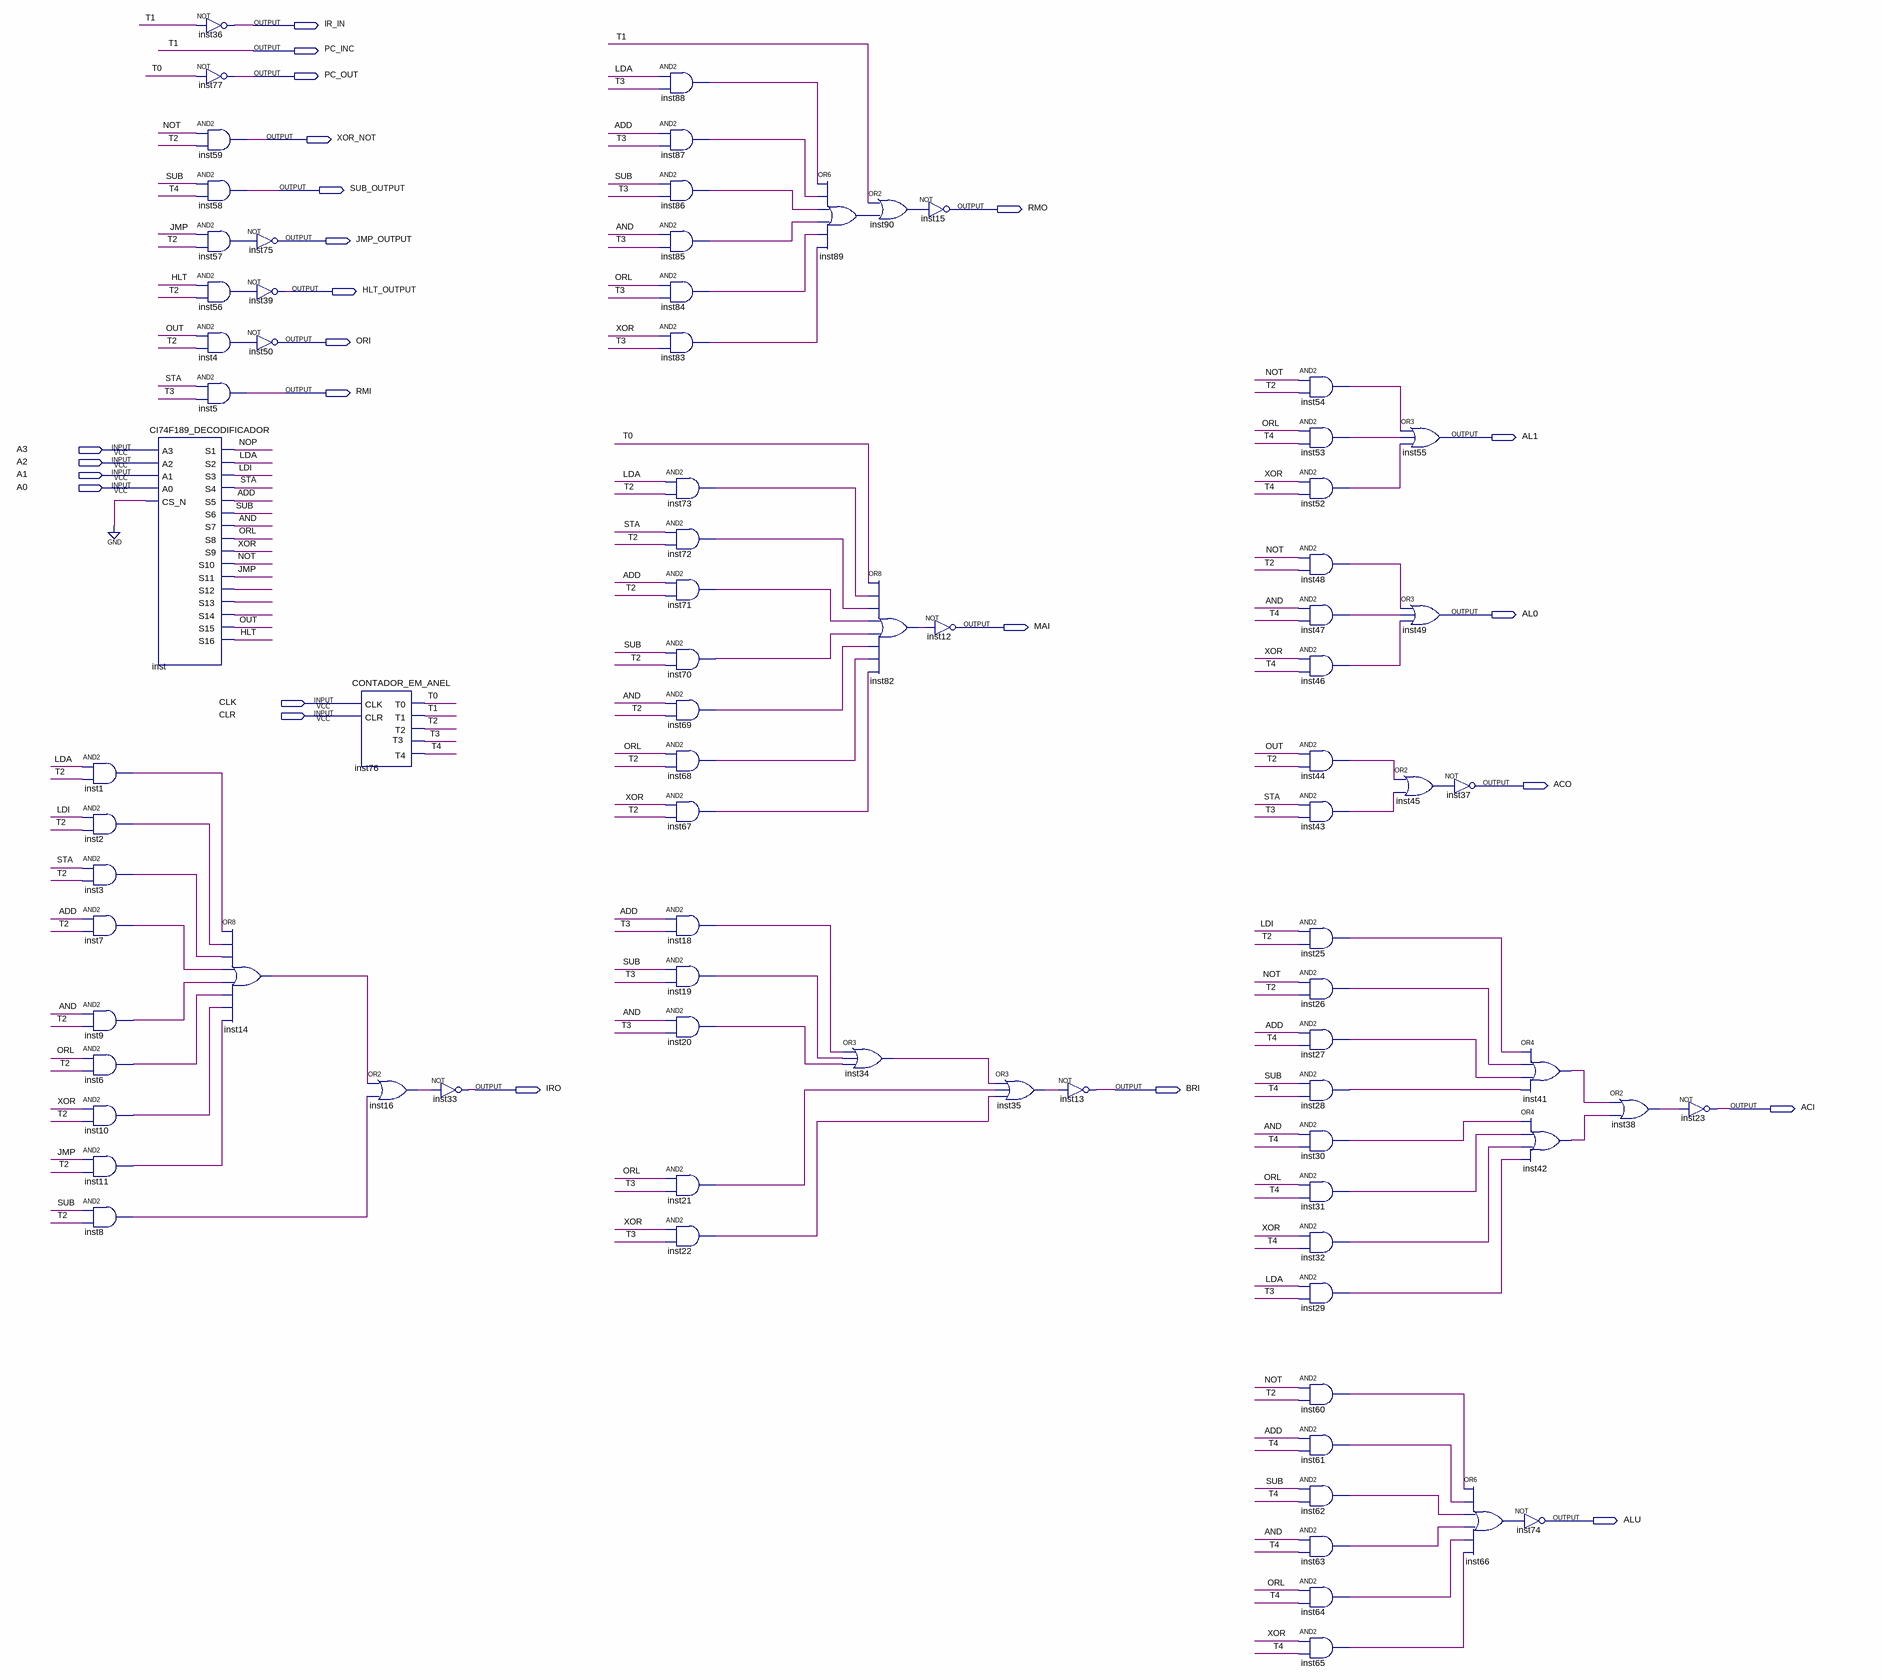
[diagram p0: schematic sheet]
// Quartus schematic CONTROLLER.bdf as structural Verilog: 83 symbols, 24 pins
module CONTROLLER (
  input  A3,
  input  A2,
  input  A1,
  input  A0,
  input  CLK,
  input  CLR,
  output IR_IN,
  output PC_INC,
  output PC_OUT,
  output XOR_NOT,
  output SUB_OUTPUT,
  output RMO,
  output JMP_OUTPUT,
  output HLT_OUTPUT,
  output ORI,
  output RMI,
  output AL1,
  output AL0,
  output MAI,
  output ACO,
  output IRO,
  output BRI,
  output ACI,
  output ALU
);

  wire ADD, AND, HLT, inst1_out, inst2_out, inst3_out, inst4_out, inst6_out, inst7_out, inst8_out, inst9_out,
       inst10_out, inst11_out, inst14_out, inst16_out, inst18_out, inst19_out, inst20_out, inst21_out,
       inst22_out, inst25_out, inst26_out, inst27_out, inst28_out, inst29_out, inst30_out, inst31_out,
       inst32_out, inst34_out, inst35_out, inst38_out, inst41_out, inst42_out, inst43_out, inst44_out,
       inst45_out, inst46_out, inst47_out, inst48_out, inst52_out, inst53_out, inst54_out, inst56_out,
       inst57_out, inst60_out, inst61_out, inst62_out, inst63_out, inst64_out, inst65_out, inst66_out,
       inst67_out, inst68_out, inst69_out, inst70_out, inst71_out, inst72_out, inst73_out, inst82_out,
       inst83_out, inst84_out, inst85_out, inst86_out, inst87_out, inst88_out, inst89_out, inst90_out,
       inst_s12, inst_s13, inst_s14, JMP, LDA, LDI, NOP, NOT, ORL, OUT, STA, SUB, T0, T2, T3, T4, XOR;

  and inst1 (inst1_out, LDA, T2);
  and inst2 (inst2_out, LDI, T2);
  and inst3 (inst3_out, STA, T2);
  and inst7 (inst7_out, ADD, T2);
  and inst9 (inst9_out, AND, T2);
  and inst6 (inst6_out, ORL, T2);
  and inst10 (inst10_out, XOR, T2);
  and inst11 (inst11_out, JMP, T2);
  and inst8 (inst8_out, SUB, T2);
  CI74F189_DECODIFICADOR inst (
    .A0(A0), .A3(A3), .A2(A2), .A1(A1), .CS_N(1'b0), .S1(NOP), .S2(LDA), .S3(LDI), .S4(STA), .S5(ADD),
    .S6(SUB), .S7(AND), .S8(ORL), .S9(XOR), .S10(NOT), .S11(JMP), .S12(inst_s12), .S13(inst_s13),
    .S14(inst_s14), .S15(OUT), .S16(HLT));
  not inst36 (IR_IN, PC_INC);
  not inst77 (PC_OUT, T0);
  and inst59 (XOR_NOT, NOT, T2);
  and inst58 (SUB_OUTPUT, SUB, T4);
  and inst57 (inst57_out, JMP, T2);
  and inst56 (inst56_out, HLT, T2);
  and inst4 (inst4_out, OUT, T2);
  and inst5 (RMI, STA, T3);
  or inst14 (inst14_out, inst1_out, inst2_out, inst3_out, inst7_out, inst9_out, inst6_out, inst10_out, inst11_out);
  not inst75 (JMP_OUTPUT, inst57_out);
  not inst39 (HLT_OUTPUT, inst56_out);
  not inst50 (ORI, inst4_out);
  CONTADOR_EM_ANEL inst76 (.CLK(CLK), .CLR(CLR), .T0(T0), .T3(T3), .T1(PC_INC), .T2(T2), .T4(T4));
  or inst16 (inst16_out, inst14_out, inst8_out);
  not inst33 (IRO, inst16_out);
  and inst88 (inst88_out, LDA, T3);
  and inst87 (inst87_out, ADD, T3);
  and inst86 (inst86_out, SUB, T3);
  and inst85 (inst85_out, AND, T3);
  and inst84 (inst84_out, ORL, T3);
  and inst83 (inst83_out, XOR, T3);
  and inst73 (inst73_out, LDA, T2);
  and inst72 (inst72_out, STA, T2);
  and inst71 (inst71_out, ADD, T2);
  and inst70 (inst70_out, SUB, T2);
  and inst69 (inst69_out, AND, T2);
  and inst68 (inst68_out, ORL, T2);
  and inst67 (inst67_out, XOR, T2);
  and inst18 (inst18_out, ADD, T3);
  and inst19 (inst19_out, SUB, T3);
  and inst20 (inst20_out, AND, T3);
  and inst21 (inst21_out, ORL, T3);
  and inst22 (inst22_out, XOR, T3);
  or inst89 (inst89_out, inst88_out, inst87_out, inst86_out, inst85_out, inst84_out, inst83_out);
  or inst90 (inst90_out, PC_INC, inst89_out);
  or inst82 (inst82_out, T0, inst73_out, inst72_out, inst71_out, inst70_out, inst69_out, inst68_out, inst67_out);
  or inst34 (inst34_out, inst18_out, inst19_out, inst20_out);
  not inst15 (RMO, inst90_out);
  not inst12 (MAI, inst82_out);
  or inst35 (inst35_out, inst34_out, inst21_out, inst22_out);
  not inst13 (BRI, inst35_out);
  and inst54 (inst54_out, NOT, T2);
  and inst53 (inst53_out, ORL, T4);
  and inst52 (inst52_out, XOR, T4);
  and inst48 (inst48_out, NOT, T2);
  and inst47 (inst47_out, AND, T4);
  and inst46 (inst46_out, XOR, T4);
  and inst44 (inst44_out, OUT, T2);
  and inst43 (inst43_out, STA, T3);
  and inst25 (inst25_out, LDI, T2);
  and inst26 (inst26_out, NOT, T2);
  and inst27 (inst27_out, ADD, T4);
  and inst28 (inst28_out, SUB, T4);
  and inst30 (inst30_out, AND, T4);
  and inst31 (inst31_out, ORL, T4);
  and inst32 (inst32_out, XOR, T4);
  and inst29 (inst29_out, LDA, T3);
  and inst60 (inst60_out, NOT, T2);
  and inst61 (inst61_out, ADD, T4);
  and inst62 (inst62_out, SUB, T4);
  and inst63 (inst63_out, AND, T4);
  and inst64 (inst64_out, ORL, T4);
  and inst65 (inst65_out, XOR, T4);
  or inst55 (AL1, inst54_out, inst53_out, inst52_out);
  or inst49 (AL0, inst48_out, inst47_out, inst46_out);
  or inst45 (inst45_out, inst44_out, inst43_out);
  not inst37 (ACO, inst45_out);
  or inst66 (inst66_out, inst60_out, inst61_out, inst62_out, inst63_out, inst64_out, inst65_out);
  or inst41 (inst41_out, inst25_out, inst26_out, inst27_out, inst28_out);
  or inst42 (inst42_out, inst30_out, inst31_out, inst32_out, inst29_out);
  not inst74 (ALU, inst66_out);
  or inst38 (inst38_out, inst41_out, inst42_out);
  not inst23 (ACI, inst38_out);

  // Other names for the same wires on the sheet: T1 = PC_INC
endmodule
